# Altium schematic sheet Temp.SchDoc
size A4
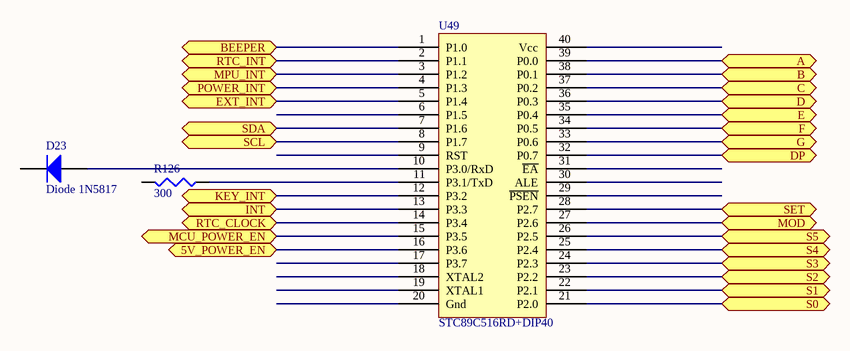
[diagram p0: Temp.SchDoc]

## Parts
D23  Diode 1N5817  [SMA]
R126  value 300  [0603]  (hidden comment: Res3)
U49  STC89C516RD+DIP40

## Ports
5V_POWER_EN (bidir), A (bidir), B (bidir), BEEPER (bidir), C (bidir), D (bidir), DP (bidir), E (bidir), EXT_INT (bidir), F (bidir), G (bidir), INT (bidir), KEY_INT (bidir), MCU_POWER_EN (bidir), MOD (bidir), MPU_INT (bidir), POWER_INT (bidir), RTC_CLOCK (bidir), RTC_INT (bidir), S0 (bidir), S1 (bidir), S2 (bidir), S3 (bidir), S4 (bidir), S5 (bidir), SCL (bidir), SDA (bidir), SET (bidir)

## Nets
5V_POWER_EN: U49.16(P3.6) ; port 5V_POWER_EN
A: U49.39(P0.0) ; port A
B: U49.38(P0.1) ; port B
BEEPER: U49.1(P1.0) ; port BEEPER
C: U49.37(P0.2) ; port C
D: U49.36(P0.3) ; port D
DP: U49.32(P0.7) ; port DP
E: U49.35(P0.4) ; port E
EXT_INT: U49.5(P1.4) ; port EXT_INT
F: U49.34(P0.5) ; port F
G: U49.33(P0.6) ; port G
INT: U49.13(P3.3) ; port INT
KEY_INT: U49.12(P3.2) ; port KEY_INT
MCU_POWER_EN: U49.15(P3.5) ; port MCU_POWER_EN
MOD: U49.27(P2.6) ; port MOD
MPU_INT: U49.3(P1.2) ; port MPU_INT
POWER_INT: U49.4(P1.3) ; port POWER_INT
RTC_CLOCK: U49.14(P3.4) ; port RTC_CLOCK
RTC_INT: U49.2(P1.1) ; port RTC_INT
S0: U49.21(P2.0) ; port S0
S1: U49.22(P2.1) ; port S1
S2: U49.23(P2.2) ; port S2
S3: U49.24(P2.3) ; port S3
S4: U49.25(P2.4) ; port S4
S5: U49.26(P2.5) ; port S5
SCL: U49.8(P1.7) ; port SCL
SDA: U49.7(P1.6) ; port SDA
SET: U49.28(P2.7) ; port SET
NetD23_1: D23.1(A) U49.10(P3.0/RxD)
NetR126_1: R126.1 U49.11(P3.1/TxD)

Not connected (* = marked no-connect by the designer): D23 2(K); R126 2; U49 6(P1.5) 9(RST) 17(P3.7) 18(XTAL2) 19(XTAL1) 20(Gnd) 29(~{PSEN}) 30(ALE) 31(~{EA}) 40(Vcc)

## Library data of the parts
D23 = Diode 1N4005: 1 Amp General Purpose Rectifier; Published: 8-Jun-2000; LatestRevisionDate: 17-Jul-2002; LatestRevisionNote: Re-released for DXP Platform.; DatasheetVersion: 1998; PackageVersion: Aug-1999; PackageReference: DO-41; Publisher: Altium Limited; PackageDescription: Diode, Axial; Body 5.2 x 2.7 mm (LxDia. max), Lead Dia. 0.86 mm (max); Code_JEDEC: DO-204-AL; ComponentLink1Description: Manufacturer Link; ComponentLink1URL: http://www.fairchildsemi.com/; ComponentLink2Description: Datasheet; ComponentLink2URL: http://www.fairchildsemi.com/ds/1N%2F1N4001.pdf
R126 = Res3: Resistor; Published: 8-Jun-2000; LatestRevisionDate: 29-May-2009; LatestRevisionNote: IPC-7351 Footprint Added.; PackageReference: J1-0603; Publisher: Altium Limited; PackageDescription: Chip Resistor